# Altium schematic sheet MainPower.SchDoc
size C; SheetNumber: 1; SheetTotal: 1
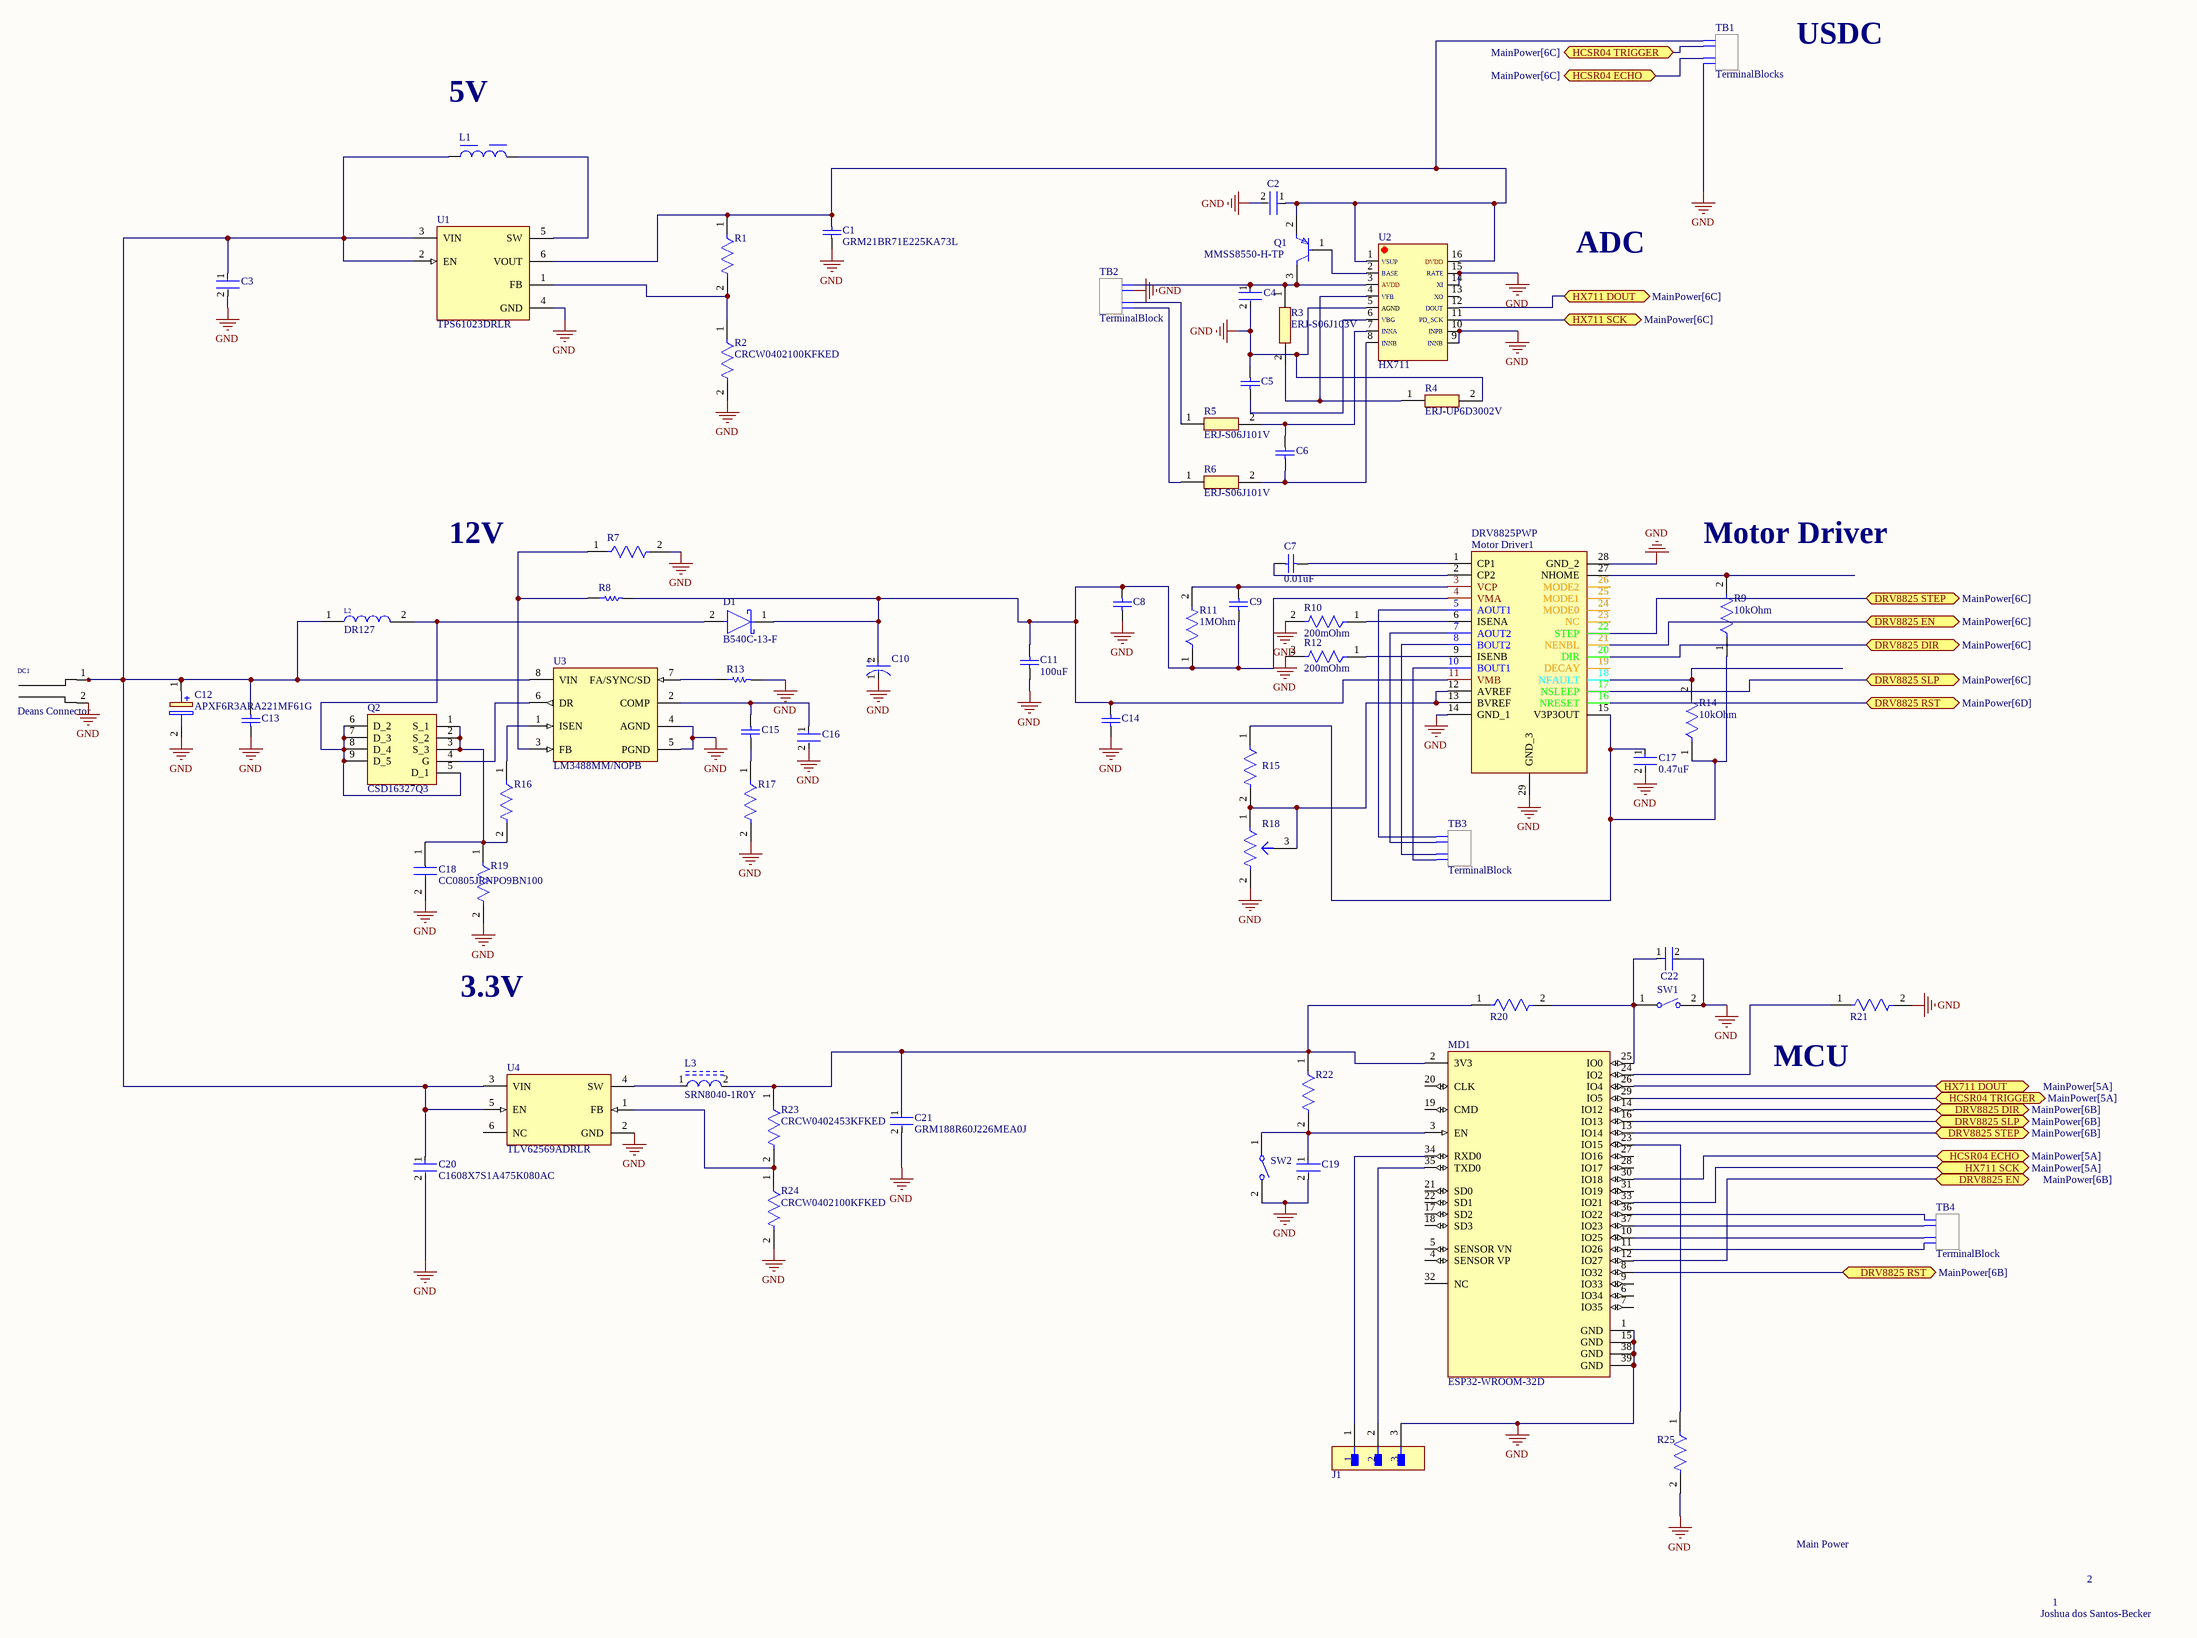
[diagram p0: MainPower.SchDoc]

## Parts
C1  GRM21BR71E225KA73L  [CAPC2013X140X45NL15T25]
C2  GRM21BR61C106KE15L  [FP-GRM21B-0_1-IPC_C]  (value not drawn)
C3  C0805C106K8PACTU  [FP-C0805C-DG-MFG]  (value not drawn)
C4  GRM21BR61C106KE15L  [FP-GRM21B-0_1-IPC_C]  (value not drawn)
C5  GRM033C71C104KE14J  [CAPC0603X33N]  (value not drawn)
C6  GRM033C71C104KE14J  [CAPC0603X33N]  (value not drawn)
C7  0.01uF  [FP-C0603-030-0_03-IPC_A]
C8  GRM033C71C104KE14J  [CAPC0603X33N]  (value not drawn)
C9  GRM033C71C104KE14J  [CAPC0603X33N]  (value not drawn)
C10  20SVPF390M  [FP-OS-CON-SMT-E12-MFG]  (value not drawn)
C11  100uF  [CAPC3225X279N]
C12  APXF6R3ARA221MF61G  [CAPAE660X610N]
C13  GRM155R70J104KA01D  [CAPC1005X55X25NL05T10]  (value not drawn)
C14  GRM033C71C104KE14J  [CAPC0603X33N]  (value not drawn)
C15  GRM155R71C183KA01D  [CAPC1005X55X25NL05T10]  (value not drawn)
C16  CC0805KRX7R9BB102  [FP-CC0805-0_85-MFG]  (value not drawn)
C17  0.47uF  [FP-1206-L_3_2_0_2-W_1_6_0-MFG]
C18  CC0805JRNPO9BN100  [CAPC2012X70N]
C19  08055C104J4T2A  [FP-0805-L_2_01_0_2-W_1_25-MFG]  (value not drawn)
C20  C1608X7S1A475K080AC  [FP-C1608-080-MFG]
C21  GRM188R60J226MEA0J  [FP-GRM188-0_2-IPC_C]
C22  08055C104J4T2A  [FP-0805-L_2_01_0_2-W_1_25-MFG]  (value not drawn)
D1  B540C-13-F  [FP-SMC-MFG]
DC1  Deans Connector  [Deans]
J1  PREC003SAAN-RC  [FP-PREC003SAAN-RC-MFG]  (value not drawn)
L1  74404043010A  [WE-LQS_4025]  (value not drawn)
L2  DR127  [DR127]
L3  SRN8040-1R0Y  [FP-SRN8040-MFG]
MD1  ESP32-WROOM-32D  [ESP32-WROOM-32D]
Motor_Driver1  DRV8825PWP  [SOP65P640X120-29N]
Q1  MMSS8550-H-TP  [FP-SOT-23-IPC_B]
Q2  CSD16327Q3  [CSD16327Q3]
R1  RC0603FR-07732KL  [FP-RC0603-0_55-IPC_A]  (value not drawn)
R2  CRCW0402100KFKED  [FP-CRCW0402-e3-IPC_C]
R3  ERJ-S06J103V  [RESC2012X70N]
R4  ERJ-UP6D3002V  [ERJUP6]
R5  ERJ-S06J101V  [RESC2012X70N]
R6  ERJ-S06J101V  [RESC2012X70N]
R7  CRCW04021K00FKED  [FP-CRCW0402-e3-MFG]  (value not drawn)
R8  CRCW04028K45FKED  [RESC1005X40X25LL05T05]  (value not drawn)
R9  10kOhm  [FP-ESR10-IPC_C]
R10  200mOhm  [WSL2512R2000FEA]
R11  1MOhm  [RESC1005X40N]
R12  200mOhm  [WSL2512R2000FEA]
R13  CRCW040226K1FKED  [RESC1005X40X25LL05T05]  (value not drawn)
R14  10kOhm  [FP-ESR10-IPC_C]
R15  (no value)  [RESC1005X40N]
R16  CRCW0402100RFKED  [FP-CRCW0402-e3-IPC_C]  (value not drawn)
R17  CRCW04025K11FKED  [FP-CRCW0402-e3-IPC_C]  (value not drawn)
R18  (no value)  [SMD Pot]
R19  PRL1632-R006-F-T1  [FP-PRL1632-MFG]  (value not drawn)
R20  ESR10EZPD1002  [FP-ESR10-IPC_C]  (value not drawn)
R21  ESR10EZPD1002  [FP-ESR10-IPC_C]  (value not drawn)
R22  ESR10EZPD1002  [FP-ESR10-IPC_C]  (value not drawn)
R23  CRCW0402453KFKED  [FP-CRCW0402-e3-MFG]
R24  CRCW0402100KFKED  [FP-CRCW0402-e3-IPC_C]
R25  ESR10EZPD1002  [FP-ESR10-IPC_C]  (value not drawn)
SW1  FSMSM  [TECO-FSMSM-2_V]  (value not drawn)
SW2  FSMSM  [TECO-FSMSM-2_V]  (value not drawn)
TB1  TerminalBlocks  [PHOENIX_1725672]
TB2  TerminalBlock  [PHOENIX_1725672]
TB3  TerminalBlock  [PHOENIX_1725672]
TB4  TerminalBlock  [PHOENIX_1725672]
U1  TPS61023DRLR  [FP-DRL0006A-MFG]
U2  HX711  [TSOP127P600X160-16N]
U3  LM3488MM/NOPB  [DGK0008A_M]
U4  TLV62569ADRLR  [FP-DRL0006A-MFG]

## Ports
DRV8825 DIR (bidir, see MainPower[6B]), DRV8825 DIR (bidir, see MainPower[6C]), DRV8825 EN (bidir, see MainPower[6B]), DRV8825 EN (bidir, see MainPower[6C]), DRV8825 RST (bidir, see MainPower[6B]), DRV8825 RST (bidir, see MainPower[6D]), DRV8825 SLP (bidir, see MainPower[6B]), DRV8825 SLP (bidir, see MainPower[6C]), DRV8825 STEP (bidir, see MainPower[6B]), DRV8825 STEP (bidir, see MainPower[6C]), HCSR04 ECHO (bidir, see MainPower[5A]), HCSR04 ECHO (bidir, see MainPower[6C]), HCSR04 TRIGGER (bidir, see MainPower[5A]), HCSR04 TRIGGER (bidir, see MainPower[6C]), HX711 DOUT (bidir, see MainPower[5A]), HX711 DOUT (bidir, see MainPower[6C]), HX711 SCK (bidir, see MainPower[5A]), HX711 SCK (bidir, see MainPower[6C])

## Nets
GND: C1.2 C2.2 C3.2 C4.2 C5.2 C8.1 C10.1(C) C11.1 C12.2(-) C13.2 C14.1 C16.2 C17.2 C18.2 C19.2 C20.2 C21.2 C22.2 DC1.2 J1.3 MD1.1(GND) MD1.15(GND) MD1.38(GND) MD1.39(GND) Motor_Driver1.14(GND_1) Motor_Driver1.28(GND_2) Motor_Driver1.29(GND_3) R2.2 R4.2 R7.2 R10.2 R12.2 R13.2 R17.2 R18.2 R19.2 R21.2 R24.2 R25.2 SW1.2 SW2.2 TB1.4 TB2.3 U1.4(GND) U2.5 U2.9 U2.10 U2.14 U2.15 U3.4(AGND) U3.5(PGND) U4.2(GND)
DRV8825 DIR: MD1.14(IO12) Motor_Driver1.20(DIR) ; port DRV8825 DIR
DRV8825 EN: MD1.12(IO27) Motor_Driver1.21(NENBL) ; port DRV8825 EN
DRV8825 RST: MD1.8(IO32) Motor_Driver1.16(NRESET) ; port DRV8825 RST
DRV8825 SLP: MD1.16(IO13) Motor_Driver1.17(NSLEEP) ; port DRV8825 SLP
DRV8825 STEP: MD1.13(IO14) Motor_Driver1.22(STEP) ; port DRV8825 STEP
HCSR04 ECHO: MD1.30(IO18) TB1.3 ; port HCSR04 ECHO
HCSR04 TRIGGER: MD1.29(IO5) TB1.2 ; port HCSR04 TRIGGER
HX711 DOUT: MD1.26(IO4) U2.12 ; port HX711 DOUT
HX711 SCK: MD1.33(IO21) U2.11 ; port HX711 SCK
NetC1_1: C1.1 C2.1 Q1.2(E) R1.1 TB1.1 U1.6(VOUT) U2.1 U2.16
NetC3_1: C3.1 C12.1(+) C13.1 C20.1 DC1.1 L1.1 L2.1 U1.2(EN) U1.3(VIN) U3.8(VIN) U4.3(VIN) U4.5(EN)
NetC4_1: C4.1 Q1.3(C) R3.1 TB2.4 U2.3
NetC5_1: C5.1 U2.6
NetC6_1: C6.1 R6.2 U2.8
NetC6_2: C6.2 R5.2 U2.7
NetC7_1: C7.1 Motor_Driver1.1(CP1)
NetC7_2: C7.2 Motor_Driver1.2(CP2)
NetC8_2: C8.2 C9.1 C10.2(A) C11.2 C14.2 D1.1(C) Motor_Driver1.4(VMA) Motor_Driver1.11(VMB) R8.2 R11.1
NetC9_2: C9.2 Motor_Driver1.3(VCP) R11.2
NetC15_1: C15.1 C16.1 U3.2(COMP)
NetC15_2: C15.2 R17.1
NetC17_1: C17.1 Motor_Driver1.15(V3P3OUT) R9.1 R14.1 R15.1
NetC18_1: C18.1 Q2.1(S_1) Q2.2(S_2) Q2.3(S_3) R16.2 R19.1
NetC19_1: C19.1 MD1.3(EN) R22.2 SW2.1
NetC21_1: C21.1 L3.2 MD1.2(3V3) R20.1 R22.1 R23.1
NetC22_1: C22.1 MD1.25(IO0) R20.2 SW1.1
NetD1_2: D1.2(A) L2.2 Q2.5(D_1) Q2.6(D_2) Q2.7(D_3) Q2.8(D_4) Q2.9(D_5)
NetJ1_1: J1.1 MD1.34(RXD0)
NetJ1_2: J1.2 MD1.35(TXD0)
NetL1_2: L1.2 U1.5(SW)
NetL3_1: L3.1 U4.4(SW)
NetMD1_10: MD1.10(IO25) TB4.3
NetMD1_11: MD1.11(IO26) TB4.4
NetMD1_23: MD1.23(IO15) R25.1
NetMD1_24: MD1.24(IO2) R21.1
NetMD1_36: MD1.36(IO22) TB4.1
NetMD1_37: MD1.37(IO23) TB4.2
NetMotor_Driver1_5: Motor_Driver1.5(AOUT1) TB3.1
NetMotor_Driver1_6: Motor_Driver1.6(ISENA) R10.1
NetMotor_Driver1_7: Motor_Driver1.7(AOUT2) TB3.2
NetMotor_Driver1_8: Motor_Driver1.8(BOUT2) TB3.3
NetMotor_Driver1_9: Motor_Driver1.9(ISENB) R12.1
NetMotor_Driver1_10: Motor_Driver1.10(BOUT1) TB3.4
NetMotor_Driver1_12: Motor_Driver1.12(AVREF) Motor_Driver1.13(BVREF) R15.2 R18.1 R18.3
NetMotor_Driver1_18: Motor_Driver1.18(NFAULT) R14.2
NetMotor_Driver1_27: Motor_Driver1.27(NHOME) R9.2
NetQ1_1: Q1.1(B) U2.2
NetQ2_4: Q2.4(G) U3.6(DR)
NetR1_2: R1.2 R2.1 U1.1(FB)
NetR3_2: R3.2 R4.1 U2.4
NetR5_1: R5.1 TB2.2
NetR6_1: R6.1 TB2.1
NetR7_1: R7.1 R8.1 U3.3(FB)
NetR13_1: R13.1 U3.7(FA/SYNC/SD)
NetR16_1: R16.1 U3.1(ISEN)
NetR23_2: R23.2 R24.1 U4.1(FB)

Not connected (* = marked no-connect by the designer): MD1 4(SENSOR_VP) 5(SENSOR_VN) 6(IO34) 7(IO35) 9(IO33) 17(SD2) 18(SD3) 19(CMD) 20(CLK) 21(SD0) 22(SD1) 27(IO16) 28(IO17) 31(IO19) 32(NC); Motor_Driver1 19(DECAY) 23(NC) 24(MODE0) 25(MODE1) 26(MODE2); U2 13; U4 6(NC)

## Notes on the sheet
- USDC
- 5V
- ADC
- 12V
- Motor Driver
- 3.3V
- MCU
- Main Power
- Joshua dos Santos-Becker
- 1
- 2
- (in symbol CMP-05428-001334-1) +
- (in symbol HX711) VSUP; DVDD; BASE; RATE; AVDD; XI; VFB; XO; AGND; DOUT; VBG; PD_SCK; INNA; INPB; INNB

## Library data of the parts
C1 = CMP-2007-03405-1: Manufacturer: Murata; Part Number: GRM21BR71E225KA73L
C2 C4 = CMP-2007-03453-2: Chip Multilayer Ceramic Capacitors for General Purpose, 0805, 10uF, X5R, 15%, 10%, 16V; Radiation Hardening: No; Thickness: 0.053inch; Voltage Rating (DC): 16V; Lead Free: Lead Free; Package Quantity: 1; Width: 1.25mm; Case Code (Imperial): 0805; Depth: 1.25mm; Packaging: Tape and Reel; Dielectric: X5R; Max Operating Temperature: 85°C; Tolerance: 10%; Voltage Rating: 16V; Voltage: 16V; Capacitance: 10uF; Height: 1.25mm; Case Code (Metric): 2012; Material: Ceramic; Mount: Surface Mount; Case/Package: 0805; REACH SVHC: No SVHC; Length: 2mm; Min Operating Temperature: -55°C; Termination: SMD/SMT
C3 = CMP-2007-03243-2: CAP CER 10UF 10V X5R 0805; Manufacturer: Kemet; 3DS Part Number: 220-00001; Tolerance: 10%; Temperature Coefficient: 15%; Material: Ceramic; Device Class L2: Capacitors; Device Class L1: Passive Components; ComponentLink2URL: https://content.kemet.com/datasheets/KEM_C1006_X5R_SMD.pdf; Height: 1.4mm; Lead Free: Yes; Manufacturer Part Number: C0805C106K8PACTU; Digikey Description: CAP CER 10UF 10V X5R 0805; Octopart: https://octopart.com/c0805c106k8pactu-kemet-98697; Capacitance: 10uF; Value: 10uF; Temperature Range Low: -55°C; Temperature: -55°C to +85°C; Automotive: No; Mouser Description: CAP CER 10UF 10V X5R 0805; Ipc Land Pattern Name: CAPC200125X125; Temperature Range High: +85°C; Voltage: 10V; RoHS: TRUE; Device Class L3: Ceramic Capacitors; ComponentLink2Description: Datasheet; Voltage Rating: 10V; Package: C0805C-DG; Temperature Characteristic: X5R; Category: Cap
C5 C6 C8 C9 C14 = 0.1uF: Manufacturer_Name: Murata Electronics; Geometry.Height: 0.33mm; Mouser Part Number: 81-GRM033C71C104KE4J; Mouser Price/Stock: https://www.mouser.co.uk/ProductDetail/Murata-Electronics/GRM033C71C104KE14J?qs=QzBtWTOodeU72T%252BpeIULSA%3D%3D; Manufacturer_Part_Number: GRM033C71C104KE14J; Datasheet Link: http://www.murata.com/~/media/webrenewal/support/library/catalog/products/capacitor/mlcc/c02e.pdf
C7 = 0.01uF: C0603X5R1C103M030BA; Voltage Rating (DC): 16V; Capacitance: 10nF; Dielectric Material: Ceramic; Dielectric: X5R; Tolerance: 20%; Length: 0.024inch; Max Operating Temperature: 85°C; Min Operating Temperature: -55°C; Case/Package: 0201; Packaging: Tape and Reel; Lead Free: Lead Free; Mount: Surface Mount; Package Quantity: 15000; Case Code (Imperial): 0201; Width: 0.012inch; RoHS Compliant: Yes; Weight: 6E-06oz; Voltage Rating: 16V; Height: 0.3mm; Thickness: 0.013inch; Case Code (Metric): 0603; Termination: SMD/SMT
C10 = CMP-05428-001334-1: Conductive Polymer Aluminum Solid Capacitors (OS-CON) 390uF ±20% 20V; Ripple Current (AC): 4.95A; Dissipation Factor: 12%; Polarity: Polar; Leakage Current: 1.56mA; Life (Hours): 5000Hour; ESR (Equivalent Series Resistance): 14mR; Voltage: 20V; RoHS Compliant: Yes; Voltage Rating: 20V; Voltage Rating (DC): 20V; Min Operating Temperature: -55°C; Length: 11.9mm; Tolerance: 20%; Ripple Current: 4.95A; Capacitance: 390uF; REACH SVHC: No SVHC; Termination: SMD/SMT; Case/Package: Radial; Series: OS-CON, SVPF; Height: 11.9mm; Height - Seated (Max): 0.472inch; Packaging: Tape and Reel; Lead Free: Lead Free; Package Quantity: 400; Mount: Surface Mount; Number of Pins: 12; Max Operating Temperature: 105°C; Diameter: 8mm; Value: 390uF
C11 = 100uF: 1210YD107MAT2A
C12 = APXF6R3ARA221MF61G: Capacitor Polarised; Manufacturer_Name: Chemi-Con; Datasheet Link: https://www.chemi-con.co.jp/products/relatedfiles/capacitor/catalog/PXFRA-e.PDF; Height: 6.1mm; Manufacturer_Part_Number: APXF6R3ARA221MF61G; Mouser Part Number: 661-APXF6R3RA221MF61; Mouser Price/Stock: https://www.mouser.co.uk/ProductDetail/United-Chemi-Con/APXF6R3ARA221MF61G?qs=p6VZ%252BklCkRRzB%2FOtUAGX5A%3D%3D; Arrow Part Number: APXF6R3ARA221MF61G; Arrow Price/Stock: https://www.arrow.com/en/products/apxf6r3ara221mf61g/united-chemi-con?region=nac
C13 = CMP-2008-04586-1: Manufacturer: Murata; Part Number: GRM155R70J104KA01D
C15 = CMP-2008-03947-1: Manufacturer: Murata; Part Number: GRM155R71C183KA01D
C16 = CMP-1036-02978-3: CAP CER 1000PF 50V X7R 0805; Manufacturer: Yageo; Tolerance: 0.1; Material: Ceramic; Capacitance: 1.0 nF; Value: 1.0 nF; Ipc Land Pattern Name: CAPC200125X85; Device Class L1: Passive Components; Temperature Range Low: -30°C; Category: Cap; ComponentLink2Description: Datasheet; Temperature: -30°C to +85°C; Device Class L2: Capacitors; Package: CC0805-0.85; Mouser Description: Multilayer Ceramic Capacitors MLCC - SMD/SMT 1.0nF 50V X7R 10%; ComponentLink2URL: http://www.yageo.com/documents/recent/UPY-GPHC_Y5V_6.3V-to-50V_8.pdf; Temperature Characteristic: X7R; Manufacturer Part Number: CC0805KRX7R9BB102; Digikey Description: CAP CER 1000PF 50V X7R 0805; Octopart: https://octopart.com/cc0805krx7r9bb102-yageo-39467744; Footprint Url: http://www.yageo.com/exep/pages/download/literatures/UPY-C_GEN_24.pdf; Temperature Range High: +85°C; Automotive: No; Voltage Rating: 50 V; RoHS: TRUE; Height: 0.95mm; Device Class L3: Ceramic Capacitors; Lead Free: Yes
C17 = CMP-04427-014563-1: 12065C474K4Z2A; Capacitance: 470nF; Voltage Rating (DC): 50V; Tolerance: 10%; Dielectric: X7R; RoHS Compliant: Yes; Radiation Hardening: No; Case Code (Metric): 3216; Mount: Surface Mount; Min Operating Temperature: -55°C; Features: Soft Termination; Case Code (Imperial): 1206; Thickness: 0.06inch; Max Operating Temperature: 125°C; Case/Package: 1206; Length: 0.126inch; Depth: 1.6mm; Packaging: Tape and Reel; Series: FLEXITERM®; Ratings: AEC-Q200; Width: 0.063inch; Voltage Rating: 50V
C18 = CC0805JRNPO9BN100: Capacitor; Manufacturer_Name: YAGEO; Datasheet Link: https://www.mouser.co.uk/datasheet/2/447/UPY_GP_NP0_16V_to_50V_18-1730511.pdf; Height: 0.7mm; Manufacturer_Part_Number: CC0805JRNPO9BN100; Mouser Part Number: 603-CC805JRNPO9BN100; Mouser Price/Stock: https://www.mouser.co.uk/ProductDetail/YAGEO/CC0805JRNPO9BN100?qs=DBlb8Oi07mYgwCvOiwRYAw%3D%3D
C19 C22 = CMP-2007-04725-2: Automotive Ceramic Capacitor, 0805, 100nF, 5%, X7R, 15%, 50V; Dissipation Factor: 2.5%; Construction: Flat; Length: 2.01mm; Series: -; Tolerance: 5%; Number of Pins: 2; Termination: SMD/SMT; Packaging: Tape and Reel; Case/Package: 0805; Mount: Surface Mount; Depth: 1.25mm; Voltage Rating (DC): 50V; Package Quantity: 4000; RoHS Compliant: Yes; Ratings: AEC-Q200; Voltage Rating: 50V; Contact Plating: Tin; Width: 0.049inch; Height: 0.94mm; Dielectric: X7R; Case Code (Metric): 2012; Min Operating Temperature: -55°C; Lead Free: Lead Free; Radiation Hardening: No; Capacitance: 100nF; Thickness: 0.037inch; Max Operating Temperature: 125°C; Case Code (Imperial): 0805
C20 = CMP-08246-005491-1: CAP CER 4.7UF 10V X7S 0603; Dielectric Material: Ceramic; Interface: I2C; Frequency: 48MHz; Memory Type: FLASH; Peripherals: Brown-out Detect/Reset; Tolerance: 10%; Oscillator Type: Internal; Number of I/Os: 53; Core Architecture: ARM; Memory Size: 64KB; Voltage Rating: 10V; Lead Free: Lead Free; Case Code (Imperial): 0603; Voltage Rating (DC): 10V; Series: Leopard Gecko; Min Operating Temperature: -40°C; Case/Package: LFBGA; Dielectric: X7S; RoHS Compliant: Yes; Package Quantity: 1000; Capacitance: 4.7uF; Thickness: 800um; Number of Pins: 64; REACH SVHC: No SVHC; Length: 1.6mm; Max Operating Temperature: 125°C; Depth: 0.8mm; Packaging: Tape and Reel; Case Code (Metric): 1608
C21 = CMP-06035-027361-1: Chip Multilayer Ceramic Capacitors for General Purpose, 0603, 22uF, X5R, 15%, 20%, 6.3V; Capacitance: 22uF; Case Code (Metric): 1608; Thickness: 0.039inch; Dielectric: X5R; Voltage Rating: 6.3V; Termination: SMD/SMT; Voltage Rating (DC): 6.3V; Width: 0.031inch; Weight: 0.000222oz; Tolerance: 20%; Case/Package: 0603; Lead Free: Lead Free; Package Quantity: 10000; Case Code (Imperial): 0603; Length: 0.063inch; Packaging: Tape and Reel; Max Operating Temperature: 85°C; Min Operating Temperature: -55°C; Mount: Surface Mount
D1 = CMP-2000-05097-3: DIODE SCHOTTKY 40V 5A SMC; Manufacturer: Diodes Inc.; Automotive Grade: NA; Peak Reverse Current: 0.5mA; Value: 300pF; Max Junction Temp: +150°C; Max Surge Forward Current: 100A; Standoff Height: 0.1mm; Digikey Description: DIODE SCHOTTKY 40V 5A SMC; Temperature Range Low: -55°C; Manufacturer Part Number: B540C-13-F; Octopart: https://octopart.com/b540c-13-f-diodes+inc.-325873; Lead Free: Yes; Reverse Voltage: 40V; RoHS: TRUE; Category: Diode; Mouser Description: Diode: Schottky rectifying; SMD; 40V; 5A; SMC; Package: reel, tape; ComponentLink2Description: Datasheet; Temperature Range High: +150°C; Automotive: No; Footprint Url: https://www.diodes.com/assets/Package-Files/SMC.pdf; Device Class L3: Schottky Diodes; Height: 2.5mm; Forward Current: 5A; Temperature: -55°C to +150°C; Package: SMC; ComponentLink2URL: https://www.diodes.com/assets/Datasheets/ds13012.pdf; Device Class L2: Diodes; Max Repetitive Reverse Voltage: 40V; Device Class L1: Discrete Semiconductors; Capacitance: 300pF
J1 = CMP-00595-22265080-1: PREC003SAAN-RC Conn Header Vert 3POS 2.54MM; Number of Contacts: 3; Connector Type: Male Pin; Current Rating: 3A; Height: 8.74mm; Contact Mating Length: 5.842mm; Min Operating Temperature: -40°C; Termination: Solder; Packaging: Bulk; Pitch: 2.54mm; Color: Black; Mount: Through Hole; Contact Material: Nickel, Tin; Number of Rows: 1; NexarPartId: 22265080; Max Operating Temperature: 105°C; RoHS: Compliant; Contact Plating: Tin; Number of Positions: 3
L1 = CMP-03913-77814851-1: 74404043010A WE-LQS SMT Semi-Shielded Power Inductor; Inductance: 1µH; Current Rating: 4.9A; Inductance Tolerance: 30%; DC Resistance (DCR): 14mΩ; Value: 1µH; Min Operating Temperature: -40°C; Length: 4mm; Max Operating Temperature: 125°C; Width: 4mm; Ambient Temperature Range Low: -40°C; RoHS: Compliant; NexarPartId: 77814851; Ambient Temperature Range High: 85°C; Height: 2.5mm
L3 = CMP-07248-000040-1: FIXED IND 1UH 7.8A 10 MOHM SMD; Inductance Tolerance: 30%; DC Resistance (DCR): 10mR; Self Resonant Frequency: 75MHz; Shielding: Shielded; Saturation Current: 11A; Core Material: Ferrite; Test Frequency: 100kHz; Current Rating: 7.8A; Composition: Wirewound; Height: 4mm; Number of Pins: 2; Inductance: 1uH; Depth: 8.3mm; REACH SVHC: No SVHC; Length: 8mm; DC Current: 7.8A; Package Quantity: 1000; Height - Seated (Max): 0.157inch; Termination: SMD/SMT; Packaging: Tape and Reel; Max DC Current: 7.8A; Min Operating Temperature: -40°C; Max Operating Temperature: 125°C; Case/Package: Nonstandard; Mount: Surface Mount; Military Standard: Not; RMS Current (Irms): 7.8A; Width: 8mm; Tolerance: 30%
MD1 = ee866abf0b6c51247b7f5cdebf2f250: RX TXRX MOD WIFI SURFACE MOUNT; Frequency: 2.5GHz; Sensitivity: -98dBm; Operating Supply Voltage: 3.6V; Data Rate: 150Mbps; Weight: 0.088185oz; Package Quantity: 550; Min Operating Temperature: -40°C; Mount: Surface Mount; Max Operating Temperature: 85°C; Packaging: Cut Tape; Case/Package: SMD/SMT
Motor_Driver1 = DRV8825PWP: 2.5A Stepper Motor Driver HTSSOP28 Texas Instruments DRV8825PWP, Stepper Motor Driver, 28-Pin HTSSOP; Geometry.Height: 1.2mm; Mouser Part Number: 595-DRV8825PWP; Mouser Price/Stock: https://www.mouser.co.uk/ProductDetail/Texas-Instruments/DRV8825PWP?qs=L4ss%2FyqpMWT%252BKNufX9tf3Q%3D%3D; Manufacturer_Name: Texas Instruments; Manufacturer_Part_Number: DRV8825PWP; Datasheet Link: http://www.ti.com/lit/ds/symlink/drv8825.pdf
Q1 = CMP-56214-000002-1: TRANS PNP 25V 1.5A SOT23; Emitter Base Voltage (VEBO): 1.6V; Collector Base Voltage (VCBO): 40V; Collector Emitter Saturation Voltage: 500mV; Max Power Dissipation: 625mW; Transition Frequency: 100MHz; Element Configuration: Single; hFE Min: 40; Polarity: PNP; Lead Free: Lead Free; Max Breakdown Voltage: 25V; Package Quantity: 1; Min Operating Temperature: -55°C; Case/Package: SOT-23; Max Collector Current: 1.5A; Mount: Surface Mount; Packaging: Tape and Reel; Collector Emitter Voltage (VCEO): 500mV; Max Operating Temperature: 150°C; Gain Bandwidth Product: 100MHz; Collector Emitter Breakdown Voltage: 25V
Q2 = CSD16327Q3: MOSFET (N-Channel); Manufacturer_Name: Texas Instruments; Datasheet Link: https://www.ti.com/lit/ds/symlink/csd16327q3.pdf?HQS=dis-mous-null-mousermode-dsf-pf-null-wwe&ts=1620965148072&ref_url=https%253A%252F%252Fwww.mouser.com%252F; Height: 1.1mm; Manufacturer_Part_Number: CSD16327Q3; Mouser Part Number: 595-CSD16327Q3; Mouser Price/Stock: https://www.mouser.co.uk/ProductDetail/Texas-Instruments/CSD16327Q3?qs=3jfYfyvUSwCG33cNK3hedw%3D%3D; Arrow Part Number: CSD16327Q3; Arrow Price/Stock: https://www.arrow.com/en/products/csd16327q3/texas-instruments?region=nac
R1 = CMP-2000-04127-2: RES SMD 732K OHM 1% 1/10W 0603; Temperature Coefficient: 100ppm/°C; Voltage Rating: 50V; Power Rating: 100mW; Resistance: 732kR; Value: 732kR; Features: Moisture Resistant; Case Code (Imperial): 0603; Series: RC; Military Standard: Not; Termination: SMD/SMT; Size Code: 0603; Depth: 0.8mm; Length: 1.6mm; Number of Terminations: 2; Case/Package: 0603; Height: 0.45mm; Construction: Rectangular; Resistor Type: Thick Film; Max Power Dissipation: 100mW; Case Code (Metric): 1608; Voltage Rating (DC): 50V; Width: 0.8mm; Tolerance: 1%; Lead Free: Lead Free; Packaging: Tape and Reel; Max Operating Temperature: 155°C; Min Operating Temperature: -55°C; RoHS Compliant: Yes
R2 = CMP-2002-08123-3: RES Thick Film, 100kΩ, 1%, 0.063W, 100ppm/°C, 0402; Power Rating: 63mW; Resistance: 100kR; Voltage Rating (DC): 50V; Value: 100kR; Lead Free: Lead Free; Height: 0.35mm; Contact Plating: Tin; Min Operating Temperature: -55°C; Package Quantity: 10000; Case/Package: 0402; Temperature Coefficient: 100ppm/°C; Number of Terminations: 2; Packaging: Tape and Reel; Max Power Dissipation: 63mW; Case Code (Metric): 1005; Mount: Surface Mount; Width: 0.02inch; Termination: SMD/SMT; Length: 1mm; Number of Pins: 2; Weight: 2.3E-05oz; Radiation Hardening: No; Tolerance: 1%; Military Standard: Not; Features: Automotive AEC-Q200; Depth: 0.5mm; Composition: Thick Film; Max Operating Temperature: 155°C; Voltage Rating: 50V; Case Code (Imperial): 0402
R3 = ERJ-S06J103V: Resistor; Manufacturer_Name: Panasonic; Datasheet Link: https://industrial.panasonic.com/cdbs/www-data/pdf/RDP0000/AOA0000C334.pdf; Height: 0.7mm; Manufacturer_Part_Number: ERJ-S06J103V; Mouser Part Number: 667-ERJ-S06J103V; Mouser Price/Stock: https://www.mouser.co.uk/ProductDetail/Panasonic/ERJ-S06J103V?qs=Zyl8A9hlmJqKI11OB00qpA%3D%3D
R4 = ERJ-UP6D3002V: Resistor; Manufacturer_Name: Panasonic; Datasheet Link: https://industrial.panasonic.com/cdbs/www-data/pdf/RDP0000/AOA0000C337.pdf; Height: 0.7mm; Manufacturer_Part_Number: ERJ-UP6D3002V
R5 R6 = ERJ-S06J101V: Resistor; Manufacturer_Name: Panasonic; Datasheet Link: https://industrial.panasonic.com/cdbs/www-data/pdf/RDP0000/AOA0000C334.pdf; Height: 0.7mm; Manufacturer_Part_Number: ERJ-S06J101V; Mouser Part Number: 667-ERJ-S06J101V; Mouser Price/Stock: https://www.mouser.co.uk/ProductDetail/Panasonic/ERJ-S06J101V?qs=Zyl8A9hlmJqshrwxn1wW6g%3D%3D
R7 = CMP-2002-08276-2: RES Thick Film, 1kΩ, 1%, 0.063W, 100ppm/°C, 0402; Resistance: 1kR; Power Rating: 63mW; Voltage Rating (DC): 50V; Value: 1kR; Package Quantity: 10; Termination: SMD/SMT; Width: 0.5mm; Military Standard: Not; Length: 1mm; Contact Plating: Tin; Mount: Surface Mount; Packaging: Tape and Reel; Case Code (Imperial): 0402; Tolerance: 1%; Weight: 2.3E-05oz; Number of Pins: 2; Case/Package: 0402; Case Code (Metric): 1005; Lead Free: Lead Free; Number of Terminations: 2; Max Power Dissipation: 63mW; Depth: 0.5mm; Temperature Coefficient: 100ppm/°C; Max Operating Temperature: 155°C; Height: 0.35mm; Features: Automotive AEC-Q200; Composition: Thick Film; Radiation Hardening: No; Voltage Rating: 50V; Min Operating Temperature: -55°C
R8 = CMP-2002-00257-1: Manufacturer: Vishay Dale; Part Number: CRCW04028K45FKED
R9 R14 = CMP-08839-028179-1: ESR10EZPD1002; RoHS Compliant: Yes
R10 R12 = 200mOhm: WSL2512R2000FEA
R11 = 1MOhm: CRCW04021M00FKEDHP
R13 = CMP-2002-08422-1: Manufacturer: Vishay Dale; Part Number: CRCW040226K1FKED
R15 = 50kOhm: CRCW040250K0FKED
R16 = CMP-1011-00397-3: RES Thick Film, 100Ω, 1%, 0.063W, 100ppm/°C, 0402; Max Power Dissipation: 63mW; Voltage Rating: 50V; Resistance: 100R; Value: 100R; Package Quantity: 10; Lead Free: Lead Free; Termination: SMD/SMT; Case Code (Metric): 1005; Number of Terminations: 2; Composition: Thick Film; Voltage Rating (DC): 50V; Min Operating Temperature: -55°C; Case/Package: 0402; Radiation Hardening: No; Max Operating Temperature: 155°C; Temperature Coefficient: 100ppm/°C; Military Standard: Not; Length: 1mm; Mount: Surface Mount; Power Rating: 63mW; Weight: 2.3E-05oz; Working Voltage: 50V; Features: Automotive AEC-Q200; Depth: 0.5mm; Packaging: Tape and Reel; Tolerance: 1%; Height: 0.35mm; Case Code (Imperial): 0402; Width: 0.02inch; Contact Plating: Tin
R17 = CMP-2002-00117-2: RES Thick Film, 5.11kΩ, 1%, 0.063W, 100ppm/°C, 0402; Power Rating: 63mW; Resistance: 5.11kR; Voltage Rating (DC): 50V; Value: 5.11kR; Lead Free: Lead Free; Depth: 0.5mm; Composition: Thick Film; Contact Plating: Tin; Mount: Surface Mount; Weight: 2.3E-05oz; Radiation Hardening: No; Packaging: Tape and Reel; Number of Pins: 2; Package Quantity: 10; Case Code (Imperial): 0402; Length: 1mm; Max Power Dissipation: 63mW; Termination: SMD/SMT; Height: 0.35mm; Temperature Coefficient: 100ppm/°C; Width: 0.02inch; Max Operating Temperature: 155°C; Case/Package: 0402; Number of Terminations: 2; Features: Automotive AEC-Q200; Min Operating Temperature: -55°C; Tolerance: 1%; Voltage Rating: 50V; Case Code (Metric): 1005; Military Standard: Not
R18 = 30kPot: TC33X-2-303E Bourns
R19 = CMP-2003-04759-2: 6 mOhms ±1% 1W Chip Resistor Wide 0612 (1632 Metric), Current Sense Thin Film; Resistance: 6mR; Temperature Coefficient: 350ppm/°C; Value: 6mR; Max Operating Temperature: 125°C; Packaging: Tape and Reel; Height: 0.024inch; Package Quantity: 1; Case Code (Imperial): 1206; Termination: SMD/SMT; Max Power Dissipation: 1W; Number of Terminations: 2; Case Code (Metric): 3216; Technology: THIN FILM; Length: 0.063inch; RoHS Compliant: Yes; Resistor Type: Thin Film; Width: 0.126inch; Series: PRL; Lead Free: Lead Free; Min Operating Temperature: -55°C; Power Rating: 1W; Case/Package: 1206; Tolerance: 1%
R20-R22 R25 = CMP-08839-028179-1: 10kΩ ±0.5% 0.4W 0805 Anti-Surge Chip Resistor AEC-Q200; RoHS Compliant: Yes
R23 = CMP-2002-00012-2: RES Thick Film, 453kΩ, 1%, 0.063W, 100ppm/°C, 0402; Resistance: 453kR; Voltage Rating (DC): 50V; Power Rating: 63mW; Features: Automotive AEC-Q200; Termination: SMD/SMT; Weight: 2.3E-05oz; Resistor Type: Thick Film; Size Code: 0402; Height: 0.016inch; RoHS Compliant: Yes; Resistance Tolerance: 1%; Construction: Rectangular; Radiation Hardening: No; Temperature Coefficient: 100ppm/°C; Series: CRCW; Depth: 0.5mm; Lead Free: Lead Free; Min Operating Temperature: -55°C; Package Quantity: 10; Length: 1mm; Case Code (Metric): 1005; Tolerance: 1%; Max Operating Temperature: 155°C; Voltage Rating: 50V; Packaging: Tape and Reel; Number of Pins: 2; Case Code (Imperial): 0402; Case/Package: 0402; Number of Terminations: 2; Contact Plating: Tin; Military Standard: Not; Max Power Dissipation: 63mW; Width: 0.5mm
R24 = CMP-2002-08123-3: RES Thick Film, 100kΩ, 1%, 0.063W, 100ppm/°C, 0402; Power Rating: 63mW; Resistance: 100kR; Voltage Rating (DC): 50V; Lead Free: Lead Free; Height: 0.35mm; Contact Plating: Tin; Min Operating Temperature: -55°C; Package Quantity: 10000; Case/Package: 0402; Temperature Coefficient: 100ppm/°C; Number of Terminations: 2; Packaging: Tape and Reel; Max Power Dissipation: 63mW; Case Code (Metric): 1005; Mount: Surface Mount; Width: 0.02inch; Termination: SMD/SMT; Length: 1mm; Number of Pins: 2; Weight: 2.3E-05oz; Radiation Hardening: No; Tolerance: 1%; Military Standard: Not; Features: Automotive AEC-Q200; Depth: 0.5mm; Composition: Thick Film; Max Operating Temperature: 155°C; Voltage Rating: 50V; Case Code (Imperial): 0402
SW1 SW2 = CMP-2000-07511-1: FSMSM Push Button Switch, 50 mA, -35 to 85 degC, 2-Pin SMD, RoHS, Bulk; Manufacturer: TE Connectivity; Actuator Length: 1.07mm; Electrical Life: 20000Cycles; Actuator Material: Polyamide; Current Rating: 50mA; Illumination Type: Illuminated; Voltage Rating (DC): 24V; Contact Resistance: 100mOhm; Case\/Package: SMD/SMT; Operating Force: 180gf; Switch Travel: 0.25mm; Max Voltage Rating (DC): 12V; Throw Configuration: SPST; Packaging: LoosePiece; Max Operating Temperature: 85degC; ELV: Compliant; Package Description: 2-Pin Surface Mount Device, Body 6 x 3.5 mm, Pitch 9.19 mm; RoHSCompliant: true; Manufacturer URL: http://www.te.com/; Contact Plating: Silver; Contact Material: Brass; Mounting Technology: SurfaceMount; Contact Current Rating: 50mA; Datasheet Version: Rev. C2, 08/2014; Datasheet URL: http://www.te.com/commerce/DocumentDelivery/DDEController?Action=showdoc&DocId=Customer+Drawing%7F1437566-3%7FC2%7Fpdf%7FEnglish%7FENG_CD_1437566-3_C2_1437566_3_1_c.dwg.pdf%7F1437566-3; Mechanical Life: 20000Cycles; Package Reference: FSMSM; REACH SVHC: Unknown; Orientation: Straight; Min Operating Temperature: -35degC; Lead Free: LeadFree; Termination: GullWing; Package Quantity: 1000; Mount: SurfaceMount
TB1 = TerminalBlock
U1 = CMP-04918-000638-1: FINISH GOODS FOR TPS61023
U3 = CMP-0063-01179-4: High Efficiency Low-Side N-Channel Controller for Switching Regulators, 8-pin MSOP, Pb-Free, 1000 Reel; Manufacturer: Texas Instruments; High-Reliability: Y; PackageTopMarking: ZXTT*S21B; CompType: MiscPower; PowerWise: N; RoHS: Y; PinCount: 8; PackageDescription: MINI SOIC, .118 x .118 x .034in, 8 Lead, .0256in Pitch; Code_JEDEC: MO-187-AA; ComponentLink1URL: http://www.ti.com/general/docs/lit/getliterature.tsp?genericPartNumber=LM3488&fileType=pdf; PartNumber: LM3488MM/NOPB; ComponentLink1Description: Datasheet URL; PackageReference: DGK0008A
U4 = CMP-04918-000167-1: IC REG BUCK ADJ 2A SOT563; Synchronous Rectifier: Yes; Output Configuration: Positive; Max Output Voltage: 5.5V; Switching Frequency: 1.5MHz; Min Input Voltage: 2.5V; Output Type: Adjustable; Min Output Voltage: 600mV; Case/Package: SOT-563; Output Current: 2A; Max Input Voltage: 5.5V; Mount: Surface Mount; Max Operating Temperature: 125°C; Min Operating Temperature: -40°C; Packaging: Tape and Reel